# EAGLE design FM REGEN RECEIVER (EAGLE 5.06)
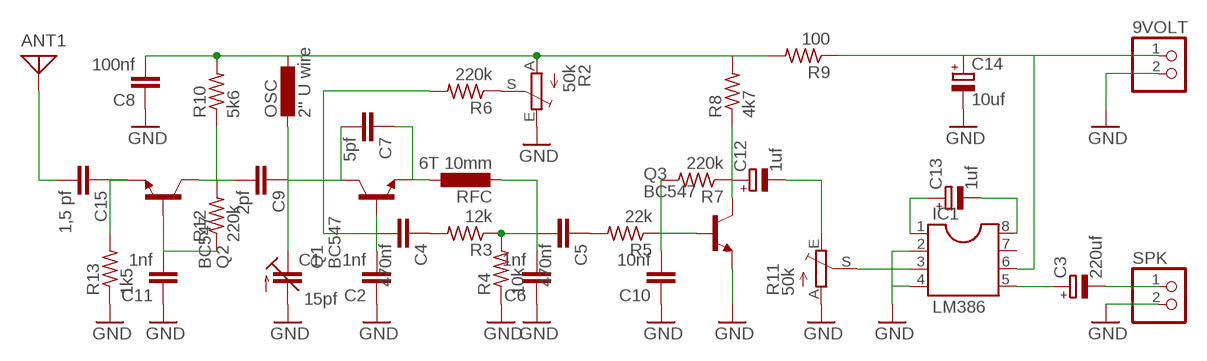
[diagram p0: schematic, sheet 1]

## Parts
9VOLT  PINHD-1X2  [1X02]
ANT1  ANTENNA  [PAD-01]
C1  15pf  C-TRIMM808-1  [CTRIM808-1]
C2  1nf  C-EU025-024X044  [C025-024X044]
C3  220uf  CPOL-EUB45181B  [B45181B]
C4  470nf  C-EU025-024X044  [C025-024X044]
C5  470nf  C-EU025-024X044  [C025-024X044]
C6  1nf  C-EU025-024X044  [C025-024X044]
C7  5pf  C-EU025-024X044  [C025-024X044]
C8  100nf  C-EU025-024X044  [C025-024X044]
C9  2pf  C-EU025-024X044  [C025-024X044]
C10  10nf  C-EU025-024X044  [C025-024X044]
C11  1nf  C-EU025-024X044  [C025-024X044]
C12  1uf  CPOL-EUB45181B  [B45181B]
C13  1uf  CPOL-EUB45181B  [B45181B]
C14  10uf  CPOL-EUB45181B  [B45181B]
C15  1,5 pf  C-EU025-024X044  [C025-024X044]
IC1  LM386  DIL8  [DIL08]
OSC  2'' U wire  L-EU0204/7  [0204/7]
Q1  BC547  [TO92]
Q2  BC547  [TO92]
Q3  BC547  [TO92]
R2  50k  TRIM_EU-CIP20C-6MM  [CIP20C-6MM]
R3  12k  R-US_0207/10  [0207/10]
R4  10k  R-US_0207/10  [0207/10]
R5  22k  R-US_0207/10  [0207/10]
R6  220k  R-US_0207/10  [0207/10]
R7  220k  R-US_0207/10  [0207/10]
R8  4k7  R-US_0207/10  [0207/10]
R9  100  R-US_0207/10  [0207/10]
R10  5k6  R-US_0207/10  [0207/10]
R11  50k  TRIM_EU-CIP20C-6MM  [CIP20C-6MM]
R12  220k  R-US_0207/10  [0207/10]
R13  1k5  R-US_0207/10  [0207/10]
RFC  6T 10mm  L-EU0204/7  [0204/7]
SPK  PINHD-1X2  [1X02]

## Nets
GND: 9VOLT.2 C1.2(A) C2.1 C6.1 C8.1 C10.1 C11.1 C14.- IC1.2 IC1.4 Q3.1(E) R2.E R4.1 R11.A R13.1 SPK.2
N$1: C4.1 R3.2
N$2: R2.S R6.1
N$3: C7.1 Q1.1(E) RFC.1
N$4: C5.1 R5.2
N$5: C2.2 C4.2 Q1.2(B) R6.2
N$6: C1.1(E) C7.2 C9.1 OSC.2 Q1.3(C)
N$8: C5.2 C6.2 R3.1 R4.2 RFC.2
N$9: C8.2 OSC.1 R2.A R8.2 R9.2 R10.2
N$10: C12.- R11.E
N$11: IC1.3 R11.S
N$12: C10.2 Q3.2(B) R5.1 R7.2
N$13: C12.+ Q3.3(C) R7.1 R8.1
N$15: C13.+ IC1.1
N$16: C13.- IC1.8
N$17: C3.+ IC1.5
N$18: C3.- SPK.1
N$20: 9VOLT.1 C14.+ IC1.6 R9.1
N$22: ANT1.1 C15.2
N$23: C15.1 Q2.1(E) R13.2
N$24: C11.2 Q2.2(B) R12.1
N$25: C9.2 Q2.3(C) R10.1 R12.2
Unconnected: IC1.7

## Library data of the parts
9VOLT SPK = pinhead:PINHD-1X2: PIN HEADER
ANT1 = discrete:ANTENNA: Antenna
C1 = resistor:C-TRIMM: Trimm capacitor
C2 C4-C11 C15 = resistor:C-EU: CAPACITOR, European symbol
C3 C12-C14 = resistor:CPOL-EU: POLARIZED CAPACITOR, European symbol
IC1 = ic-package:DIL8: Dual In Line / Socket
OSC RFC = resistor:L-EU: INDUCTOR, European symbol
Q1-Q3 = transistor-npn:BC547*: NPN Transistor
R2 R11 = pot:TRIM_EU-: POTENTIOMETER
R3-R10 R12 R13 = resistor:R-US_: RESISTOR, American symbol

## Board
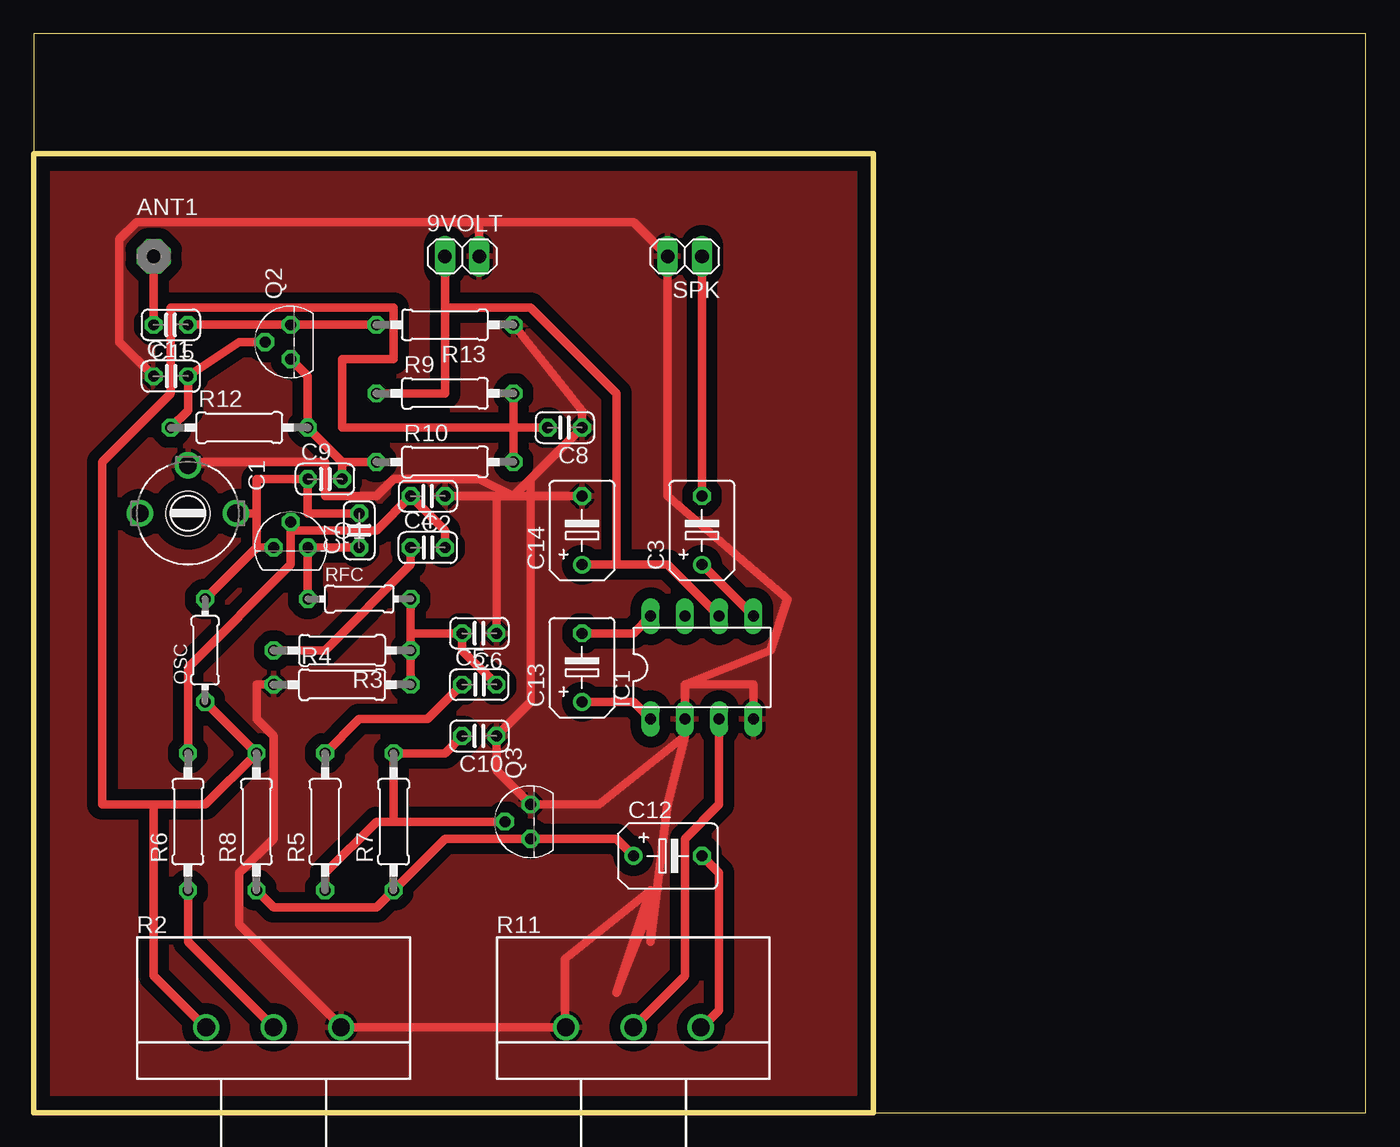
[diagram p1: board, top side]

Size 98.73 x 80 mm. Coordinates in mm from the lower left corner, seen from the top.
Outline: 62.23,0 98.73,0 98.73,80 0,80 0,71.12
Outline: 0,71.12 62.23,71.12 62.23,0
Outline: 62.23,0 0,0 0,71.12
Copper layers (1*16): Top 0.035mm / dielectric 1.5mm / Bottom 0.035mm
Design rules "default *": minimum track width 25mil, minimum drill 24mil, track to track 10mil, track to pad 10mil, pad to pad 10mil, via to via 10mil, smd to smd 8mil, copper to edge 40mil, drill to drill 8mil, minimum pad ring 10mil, minimum via ring 8mil, stop-mask expansion 4mil, vias tented up to drill 0mil, thermal gap 10mil

### Footprints (pad centres in the part's own frame; a part is rotated, then mirrored left to right if it is on the bottom)
1X02 = drill 1.016 long: 1 -1.27,0; 2 1.27,0
PAD-01 = drill 1.321 pad 2.54 octagon: 1 0,0
CTRIM808-1 = drill 1.321 round: 1 -3.556,0; 2 0,-3.556; 3 3.556,0 | hole 3.302: 0,0
C025-024X044 = drill 0.813 octagon: 1 -1.27,0; 2 1.27,0
B45181B = drill 0.813 round: + -2.54,0 | drill 0.813 octagon: - 2.54,0
DIL08 = drill 0.813 long: 1 -3.81,-3.81; 2 -1.27,-3.81; 3 1.27,-3.81; 4 3.81,-3.81; 5 3.81,3.81; 6 1.27,3.81; 7 -1.27,3.81; 8 -3.81,3.81
0204/7 = drill 0.813 octagon: 1 -3.81,0; 2 3.81,0
TO92 = drill 0.813 octagon: 1 1.27,0; 2 0,1.905; 3 -1.27,0
CIP20C-6MM = drill 1.3 pad 1.93 round: A -5,0; E 5,0; S 0,0
0207/10 = drill 0.813 octagon: 1 -5.08,0; 2 5.08,0

### Placement (x,y rotation side)
9VOLT  31.75,63.5 0 top
ANT1  8.89,63.5 0 top
C1  11.43,44.45 180 top
C2  29.21,45.72 180 top
C3  49.53,43.18 90 top
C4  29.21,41.91 0 top
C5  33.02,31.75 0 top
C6  33.02,35.56 180 top
C7  24.13,43.18 90 top
C8  39.37,50.8 180 top
C9  21.59,46.99 0 top
C10  33.02,27.94 180 top
C11  10.16,54.61 0 top
C12  46.99,19.05 0 top
C13  40.64,33.02 90 top
C14  40.64,43.18 90 top
C15  10.16,58.42 180 top
IC1  49.53,33.02 0 top
OSC  12.7,34.29 90 top
Q1  19.05,41.91 0 top
Q2  19.05,57.15 90 top
Q3  36.83,21.59 90 top
R2  17.78,6.35 0 top
R3  22.86,34.29 180 top
R4  22.86,31.75 0 top
R5  21.59,21.59 90 top
R6  11.43,21.59 90 top
R7  26.67,21.59 90 top
R8  16.51,21.59 90 top
R9  30.48,53.34 0 top
R10  30.48,48.26 0 top
R11  44.45,6.35 0 top
R12  15.24,50.8 0 top
R13  30.48,58.42 180 top
RFC  24.13,38.1 0 top
SPK  48.26,63.5 180 top

### Tracks (layer width: path | path; a pad name or v marks a point on that pad's centre or on a via)
GND
  Top 0.635: R4.1 16.51,31.75 16.51,29.21 17.78,27.94 17.78,20.32 15.24,17.78 15.24,13.97 22.86,6.35 | 22.86,6.35 39.37,6.35 | R2.E 22.86,6.35 | C11.1 6.35,57.15 6.35,64.77 7.62,66.04 33.02,66.04 | 33.02,66.04 44.45,66.04 SPK.2 46.99,45.72 55.88,38.1 54.61,34.29 48.26,31.75 | 33.02,66.04 9VOLT.2 | 48.26,27.94 41.91,22.86 Q3.1 34.29,25.4 C10.1 36.83,30.48 36.83,45.72 | 48.26,27.94 IC1.2 48.26,31.75 | 48.26,31.75 53.34,31.75 IC1.4 | 36.83,45.72 C14.- | 36.83,45.72 34.29,45.72 | 34.29,45.72 C2.1 | 34.29,45.72 C6.1 | 36.83,45.72 36.83,46.99 | 36.83,46.99 C8.1 40.64,52.07 R13.1 | 36.83,46.99 35.56,45.72 33.02,46.99 26.67,46.99 25.4,45.72 21.59,45.72 21.59,48.26 11.43,48.26 C1.2 | 39.37,6.35 39.37,11.43 45.72,16.51 43.18,8.89 45.72,15.24 45.72,12.7 46.99,22.86 48.26,27.94 | 39.37,6.35 R11.A
  pour Top (isolate 0.813): 0,69.85 60.96,69.85 60.96,1.27 60.96,0 0,0
N$1
  Top 0.635: R3.2 21.59,34.29 27.94,40.64 C4.1
N$2
  Top 0.635: R6.1 11.43,12.7 R2.S
N$3
  Top 0.635: RFC.1 Q1.1 C7.1
N$4
  Top 0.635: R5.2 24.13,29.21 29.21,29.21 C5.1
N$5
  Top 0.635: C4.2 30.48,43.18 C2.2 25.4,43.18 19.05,43.18 | R6.2 11.43,33.02 19.05,40.64 19.05,43.18 | 19.05,43.18 Q1.2
N$6
  Top 0.635: OSC.2 16.51,41.91 | 16.51,41.91 Q1.3 | 16.51,44.45 16.51,46.99 C9.1 20.32,44.45 C7.2 | 16.51,44.45 C1.1 | 16.51,41.91 16.51,44.45
N$7
  pour Top (isolate 0.813): 6.35,43.18 15.24,43.18 15.24,26.67 12.7,24.13 6.35,24.13
N$8
  Top 0.635: R3.1 R4.2 27.94,35.56 | 27.94,35.56 RFC.2 | 27.94,35.56 C6.2 31.75,34.29 C5.2
N$9
  Top 0.635: 35.56,50.8 R9.2 | 35.56,50.8 R10.2 | 35.56,50.8 C8.2 | OSC.1 R8.2 12.7,22.86 8.89,22.86 | 8.89,22.86 8.89,10.16 12.7,6.35 R2.A | 35.56,50.8 22.86,50.8 22.86,55.88 26.67,55.88 26.67,59.69 10.16,59.69 10.16,53.34 5.08,48.26 5.08,22.86 8.89,22.86
N$10
  Top 0.635: C12.- 50.8,17.78 50.8,7.62 49.53,6.35 R11.E
N$11
  Top 0.635: IC1.3 50.8,22.86 48.26,20.32 48.26,10.16 R11.S
N$12
  Top 0.635: R5.1 21.59,17.78 25.4,21.59 26.67,21.59 | 26.67,21.59 R7.2 30.48,26.67 C10.2 | 26.67,21.59 Q3.2
N$13
  Top 0.635: C12.+ 43.18,20.32 Q3.3 30.48,20.32 R7.1 25.4,15.24 17.78,15.24 R8.1
N$14
  pour Top (isolate 0.813): 8.89,46.99 8.89,40.64 12.7,40.64 13.97,46.99
N$15
  Top 0.635: C13.+ 44.45,30.48 IC1.1
N$16
  Top 0.635: C13.- 44.45,35.56 IC1.8
N$17
  Top 0.635: IC1.5 C3.+
N$18
  Top 0.635: C3.- SPK.1
N$20
  Top 0.635: 43.18,40.64 46.99,40.64 IC1.6 | 43.18,40.64 C14.+ | R9.1 30.48,53.34 30.48,59.69 | 30.48,59.69 9VOLT.1 | 43.18,40.64 43.18,53.34 36.83,59.69 30.48,59.69
N$22
  Top 0.635: C15.2 ANT1.1
N$23
  Top 0.635: C15.1 Q2.1 R13.2
N$24
  Top 0.635: R12.1 11.43,52.07 C11.2 15.24,57.15 Q2.2
N$25
  Top 0.635: 22.86,48.26 R10.1 | C9.2 22.86,48.26 | 22.86,48.26 R12.2 20.32,54.61 Q2.3